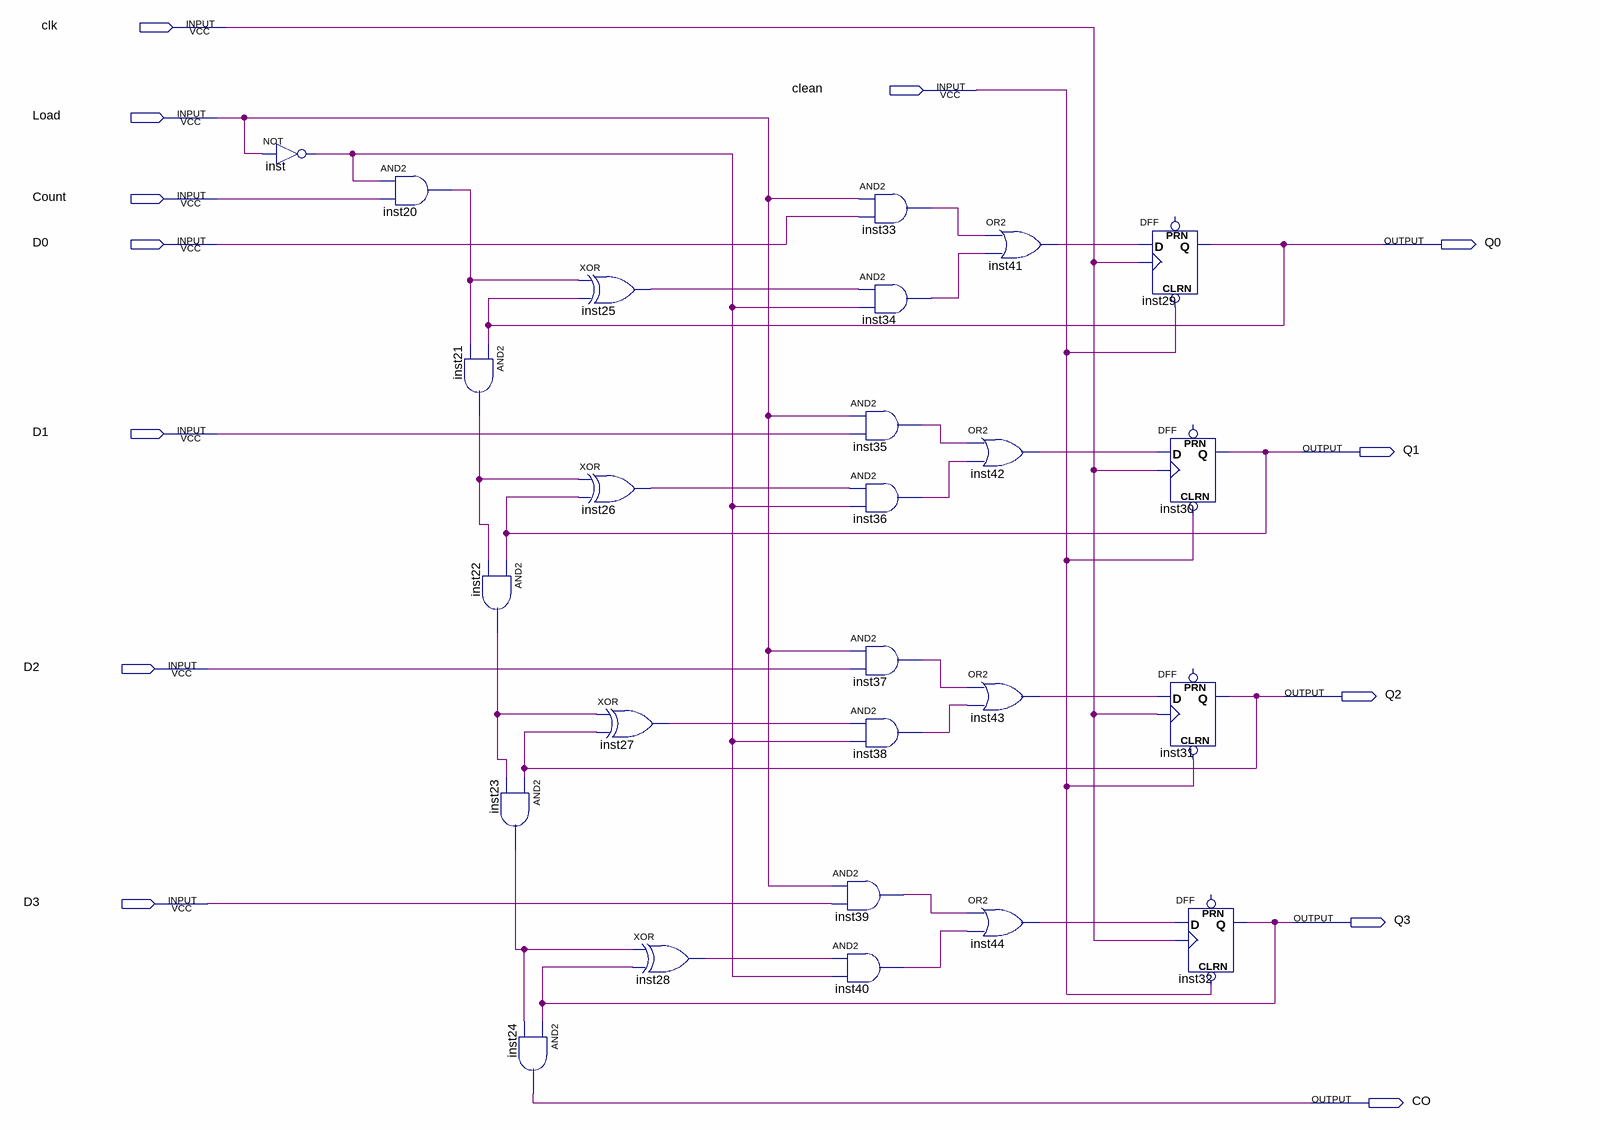
[diagram p0: schematic sheet]
// Quartus schematic lab04.bdf as structural Verilog: 26 symbols, 13 pins
module lab04 (
  input  clk,
  input  clean,
  input  Load,
  input  Count,
  input  D0,
  input  D1,
  input  D2,
  input  D3,
  output Q0,
  output Q1,
  output Q2,
  output Q3,
  output CO
);

  wire inst20_out, inst21_out, inst22_out, inst23_out, inst25_out, inst26_out, inst27_out, inst28_out,
       inst33_out, inst34_out, inst35_out, inst36_out, inst37_out, inst38_out, inst39_out, inst40_out,
       inst41_out, inst42_out, inst43_out, inst44_out, inst_out;

  not inst (inst_out, Load);
  and inst20 (inst20_out, inst_out, Count);
  and inst21 (inst21_out, Q0, inst20_out);
  and inst22 (inst22_out, Q1, inst21_out);
  and inst23 (inst23_out, Q2, inst22_out);
  and inst24 (CO, Q3, inst23_out);
  xor inst25 (inst25_out, inst20_out, Q0);
  xor inst26 (inst26_out, inst21_out, Q1);
  xor inst27 (inst27_out, inst22_out, Q2);
  xor inst28 (inst28_out, inst23_out, Q3);
  and inst33 (inst33_out, Load, D0);
  and inst34 (inst34_out, inst25_out, inst_out);
  and inst35 (inst35_out, Load, D1);
  and inst36 (inst36_out, inst26_out, inst_out);
  and inst37 (inst37_out, Load, D2);
  and inst38 (inst38_out, inst27_out, inst_out);
  and inst39 (inst39_out, Load, D3);
  and inst40 (inst40_out, inst28_out, inst_out);
  or inst41 (inst41_out, inst33_out, inst34_out);
  or inst42 (inst42_out, inst35_out, inst36_out);
  or inst43 (inst43_out, inst37_out, inst38_out);
  or inst44 (inst44_out, inst39_out, inst40_out);
  DFF inst29 (.CLRN(clean), .CLK(clk), .D(inst41_out), .Q(Q0));  // open: PRN
  DFF inst30 (.CLRN(clean), .CLK(clk), .D(inst42_out), .Q(Q1));  // open: PRN
  DFF inst31 (.CLRN(clean), .CLK(clk), .D(inst43_out), .Q(Q2));  // open: PRN
  DFF inst32 (.CLRN(clean), .CLK(clk), .D(inst44_out), .Q(Q3));  // open: PRN
endmodule
